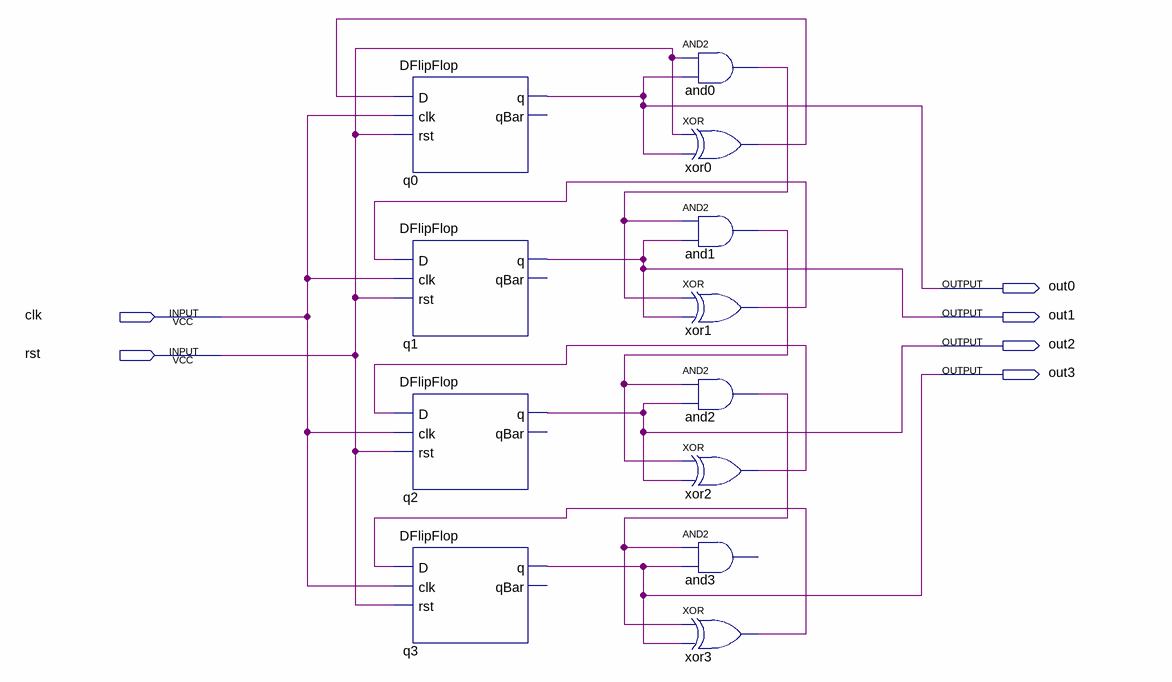
[diagram p0: schematic sheet]
// Quartus schematic SynchronousDownCounterSchematic.bdf as structural Verilog: 12 symbols, 6 pins
module SynchronousDownCounterSchematic (
  input  clk,
  input  rst,
  output out0,
  output out1,
  output out2,
  output out3
);

  wire and0_out, and1_out, and2_out, xor0_out, xor1_out, xor2_out, xor3_out;

  DFlipFlop q0 (.D(xor0_out), .clk(clk), .rst(rst), .q(out0));  // open: qBar
  DFlipFlop q1 (.D(xor1_out), .clk(clk), .rst(rst), .q(out1));  // open: qBar
  DFlipFlop q2 (.D(xor2_out), .clk(clk), .rst(rst), .q(out2));  // open: qBar
  DFlipFlop q3 (.D(xor3_out), .clk(clk), .rst(rst), .q(out3));  // open: qBar
  and and0 (and0_out, rst, out0);
  xor xor0 (xor0_out, rst, out0);
  and and1 (and1_out, and0_out, out1);
  xor xor1 (xor1_out, and0_out, out1);
  and and2 (and2_out, and1_out, out2);
  xor xor2 (xor2_out, and1_out, out2);
  // AND2 and3 has open pins: IN1=and2_out, IN2=out3, OUT=open
  xor xor3 (xor3_out, and2_out, out3);
endmodule
